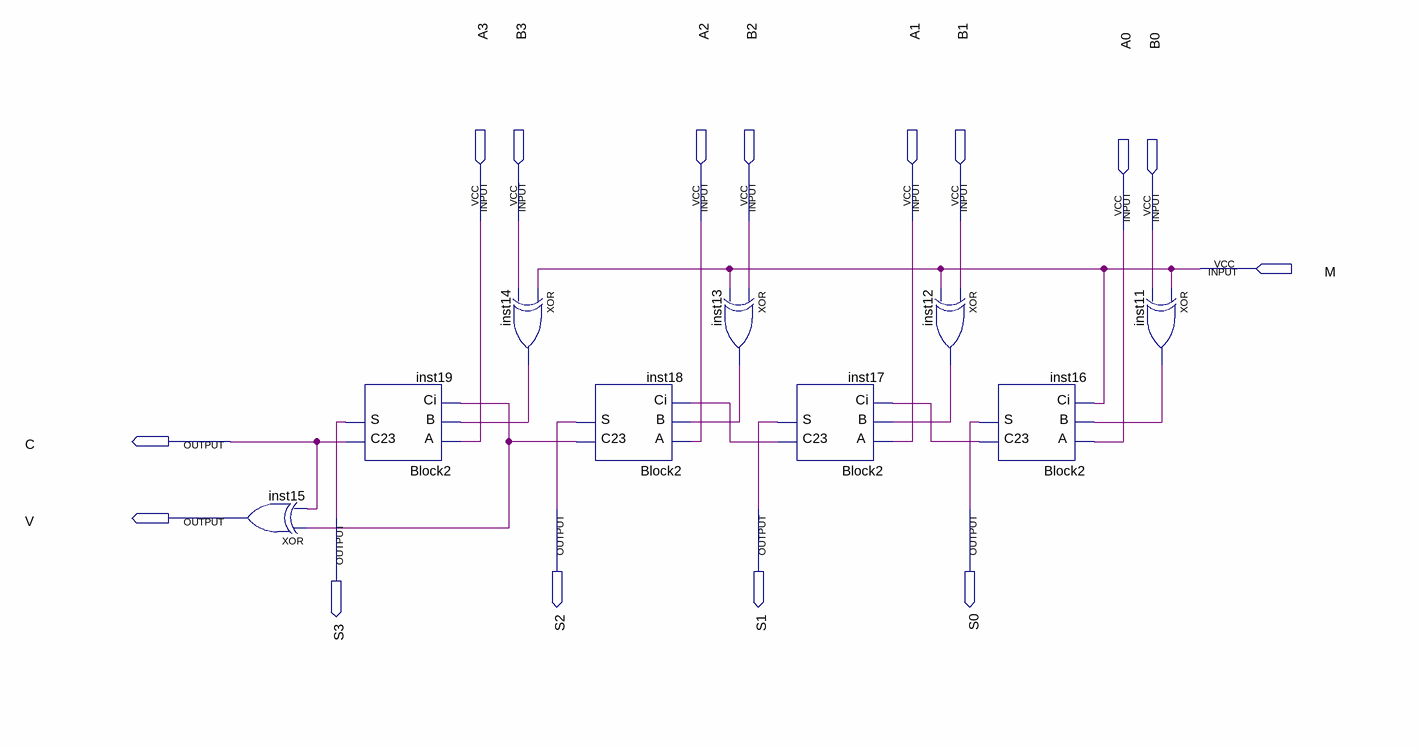
[diagram p0: schematic sheet]
// Quartus schematic lab03.bdf as structural Verilog: 9 symbols, 15 pins
module lab03 (
  input  A3,
  input  B3,
  input  A2,
  input  B2,
  input  A1,
  input  B1,
  input  A0,
  input  B0,
  input  M,
  output C,
  output S2,
  output S1,
  output S0,
  output V,
  output S3
);

  wire inst11_out, inst12_out, inst13_out, inst14_out, inst16_c23, inst17_c23, inst18_c23;

  xor inst15 (V, inst18_c23, C);
  Block2 inst19 (.A(A3), .B(inst14_out), .Ci(inst18_c23), .C23(C), .S(S3));
  xor inst14 (inst14_out, M, B3);
  Block2 inst18 (.A(A2), .B(inst13_out), .Ci(inst17_c23), .C23(inst18_c23), .S(S2));
  xor inst13 (inst13_out, B2, M);
  Block2 inst17 (.A(A1), .B(inst12_out), .Ci(inst16_c23), .C23(inst17_c23), .S(S1));
  xor inst12 (inst12_out, B1, M);
  Block2 inst16 (.A(A0), .B(inst11_out), .Ci(M), .C23(inst16_c23), .S(S0));
  xor inst11 (inst11_out, M, B0);
endmodule
